# Altium schematic sheet top.SchDoc: Triumvi - Top
size Letter; Author: Ye-Sheng Kuo; Revision: 11; SheetNumber: 1; SheetTotal: 10
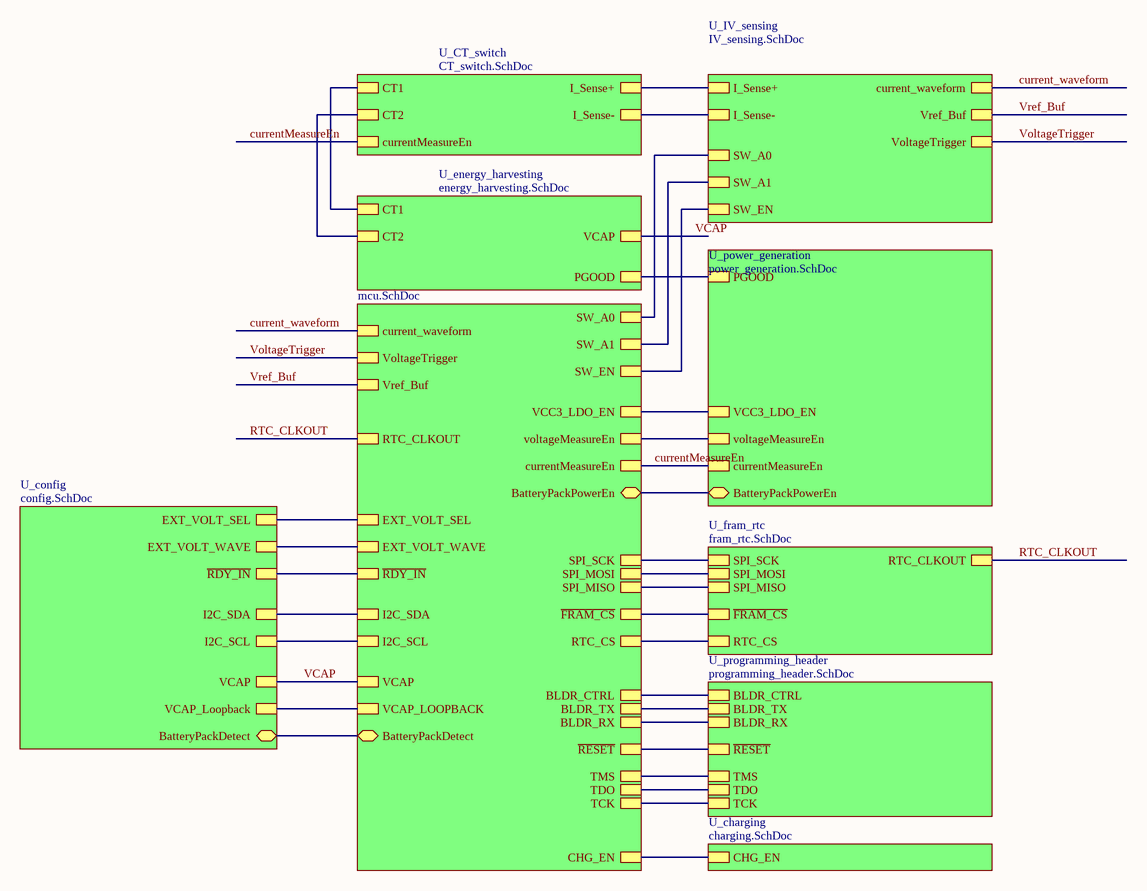
[diagram p0: top.SchDoc]

## Sub-sheets
U_charging = charging.SchDoc: CHG_EN
U_config = config.SchDoc: VCAP_Loopback, VCAP, EXT_VOLT_WAVE, EXT_VOLT_SEL, I2C_SDA, I2C_SCL, ~{RDY_IN}, BatteryPackDetect
U_CT_switch = CT_switch.SchDoc: CT1, CT2, currentMeasureEn, I_Sense+, I_Sense-
U_energy_harvesting = energy_harvesting.SchDoc: CT1, CT2, PGOOD, VCAP
U_fram_rtc = fram_rtc.SchDoc: SPI_MOSI, SPI_SCK, SPI_MISO, RTC_CS, ~{FRAM_CS}, RTC_CLKOUT
U_IV_sensing = IV_sensing.SchDoc: current_waveform, Vref_Buf, VoltageTrigger, I_Sense+, I_Sense-, SW_A0, SW_A1, SW_EN
U_mcu = mcu.SchDoc: current_waveform, Vref_Buf, voltageMeasureEn, currentMeasureEn, VoltageTrigger, ~{FRAM_CS}, SPI_SCK, SPI_MOSI, SPI_MISO, RTC_CS, I2C_SCL, I2C_SDA, EXT_VOLT_SEL, EXT_VOLT_WAVE, TDO, BLDR_CTRL, BLDR_TX, BLDR_RX, ~{RESET}, TMS, TCK, VCC3_LDO_EN, VCAP_LOOPBACK, VCAP, ~{RDY_IN}, SW_EN, RTC_CLKOUT, SW_A0, SW_A1, CHG_EN, BatteryPackPowerEn, BatteryPackDetect
U_power_generation = power_generation.SchDoc: PGOOD, VCC3_LDO_EN, voltageMeasureEn, currentMeasureEn, BatteryPackPowerEn
U_programming_header = programming_header.SchDoc: ~{RESET}, TMS, TCK, TDO, BLDR_CTRL, BLDR_TX, BLDR_RX

## Nets
current_waveform: sheet U_mcu/current_waveform, sheet U_IV_sensing/current_waveform
currentMeasureEn: sheet U_mcu/currentMeasureEn, sheet U_CT_switch/currentMeasureEn, sheet U_power_generation/currentMeasureEn
RTC_CLKOUT: sheet U_mcu/RTC_CLKOUT, sheet U_fram_rtc/RTC_CLKOUT
VCAP: sheet U_mcu/VCAP, sheet U_config/VCAP, sheet U_energy_harvesting/VCAP
VoltageTrigger: sheet U_mcu/VoltageTrigger, sheet U_IV_sensing/VoltageTrigger
Vref_Buf: sheet U_mcu/Vref_Buf, sheet U_IV_sensing/Vref_Buf
(unnamed): sheet U_mcu/voltageMeasureEn, sheet U_power_generation/voltageMeasureEn
(unnamed): sheet U_mcu/~{FRAM_CS}, sheet U_fram_rtc/~{FRAM_CS}
(unnamed): sheet U_mcu/SPI_SCK, sheet U_fram_rtc/SPI_SCK
(unnamed): sheet U_mcu/SPI_MOSI, sheet U_fram_rtc/SPI_MOSI
(unnamed): sheet U_mcu/SPI_MISO, sheet U_fram_rtc/SPI_MISO
(unnamed): sheet U_mcu/RTC_CS, sheet U_fram_rtc/RTC_CS
(unnamed): sheet U_mcu/I2C_SCL, sheet U_config/I2C_SCL
(unnamed): sheet U_mcu/I2C_SDA, sheet U_config/I2C_SDA
(unnamed): sheet U_mcu/EXT_VOLT_SEL, sheet U_config/EXT_VOLT_SEL
(unnamed): sheet U_mcu/EXT_VOLT_WAVE, sheet U_config/EXT_VOLT_WAVE
(unnamed): sheet U_mcu/TDO, sheet U_programming_header/TDO
(unnamed): sheet U_mcu/BLDR_CTRL, sheet U_programming_header/BLDR_CTRL
(unnamed): sheet U_mcu/BLDR_TX, sheet U_programming_header/BLDR_TX
(unnamed): sheet U_mcu/BLDR_RX, sheet U_programming_header/BLDR_RX
(unnamed): sheet U_mcu/~{RESET}, sheet U_programming_header/~{RESET}
(unnamed): sheet U_mcu/TMS, sheet U_programming_header/TMS
(unnamed): sheet U_mcu/TCK, sheet U_programming_header/TCK
(unnamed): sheet U_mcu/VCC3_LDO_EN, sheet U_power_generation/VCC3_LDO_EN
(unnamed): sheet U_mcu/VCAP_LOOPBACK, sheet U_config/VCAP_Loopback
(unnamed): sheet U_mcu/~{RDY_IN}, sheet U_config/~{RDY_IN}
(unnamed): sheet U_mcu/SW_EN, sheet U_IV_sensing/SW_EN
(unnamed): sheet U_mcu/SW_A0, sheet U_IV_sensing/SW_A0
(unnamed): sheet U_mcu/SW_A1, sheet U_IV_sensing/SW_A1
(unnamed): sheet U_mcu/CHG_EN, sheet U_charging/CHG_EN
(unnamed): sheet U_mcu/BatteryPackPowerEn, sheet U_power_generation/BatteryPackPowerEn
(unnamed): sheet U_mcu/BatteryPackDetect, sheet U_config/BatteryPackDetect
(unnamed): sheet U_CT_switch/CT1, sheet U_energy_harvesting/CT1
(unnamed): sheet U_CT_switch/CT2, sheet U_energy_harvesting/CT2
(unnamed): sheet U_CT_switch/I_Sense+, sheet U_IV_sensing/I_Sense+
(unnamed): sheet U_CT_switch/I_Sense-, sheet U_IV_sensing/I_Sense-
(unnamed): sheet U_energy_harvesting/PGOOD, sheet U_power_generation/PGOOD

## Notes on the sheet
- Title
- Date:
- Author:
- Revision:
- Sheet
- of
- University of Michigan
- File: